# EAGLE design mp28164-buck-boost-flashlight-driver-tester-mk-2.0.3 (EAGLE 9.2.2)
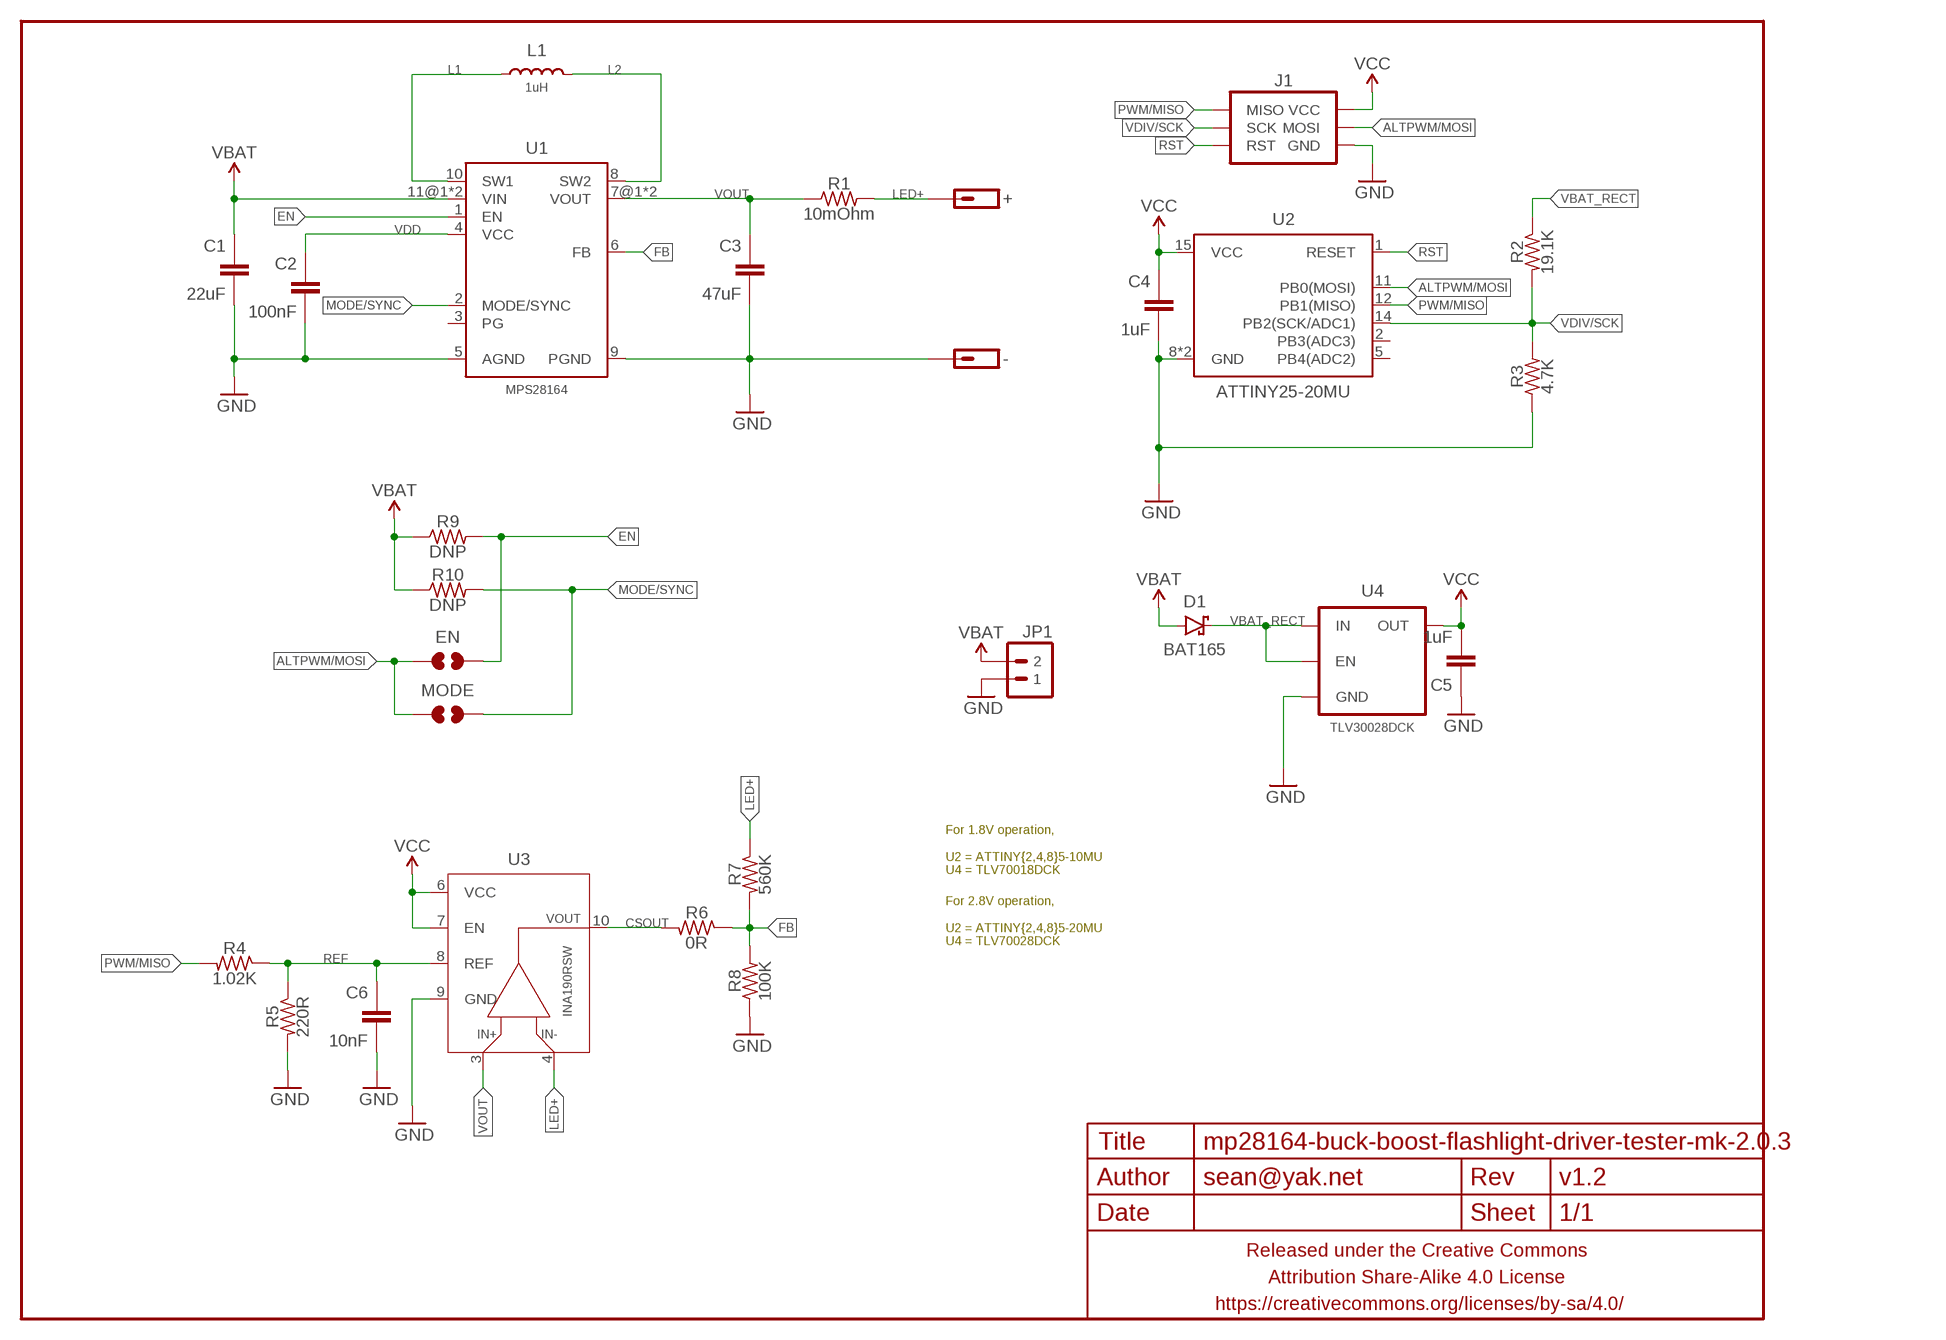
[diagram p0: schematic, sheet 1]

## Parts
+  M01PTH-1.2MM-NS  [1X01-1.2MM-NS]
-  M01PTH-1.2MM-NS  [1X01-1.2MM-NS]
C1  22uF  CAPACITOR-CERAMICC1206  [C1206]
C2  100nF  CAPACITOR-CERAMICC0402  [C0402]
C3  47uF  CAPACITOR-CERAMICC1206  [C1206]
C4  1uF  CAPACITOR-CERAMICC0402  [C0402]
C5  1uF  CAPACITOR-CERAMICC0402  [C0402]
C6  10nF  CAPACITOR-CERAMICC0402  [C0402]
D1  BAT165  DIODE-SCHOTTKYSOD323  [SOD323-SCHOTTKY]
EN  JUMPER-PAD-2-NOYES_SILK  [PAD-JUMPER-2-NO_YES_SILK]
FRAME1  FRAME-LETTERNO_PACKAGE  [DUMMY]
J1  AVR_SPI_PRG_6PTH  [2X3]
JP1  M02PTH-CENTERED  [1X02-CENTER]
L1  1uH  INDUCTORXAL60XX  [XAL60XX]
MODE  JUMPER-PAD-2-NOYES_SILK  [PAD-JUMPER-2-NO_YES_SILK]
R1  10mOhm  RESISTORR1206  [R1206]
R2  19.1K  RESISTORR0402  [R0402]
R3  4.7K  RESISTORR0402  [R0402]
R4  1.02K  RESISTORR0402  [R0402]
R5  220R  RESISTORR0402  [R0402]
R6  0R  RESISTORR0402  [R0402]
R7  560K  RESISTORR0402  [R0402]
R8  100K  RESISTORR0402  [R0402]
R9  DNP  RESISTORR0402  [R0402]
R10  DNP  RESISTORR0402  [R0402]
U1  MPS28164  [MPS28164]
U2  ATTINY25-20MU  ATTINY45TINY85-20-QFN  [QFN20]
U3  INA190RSW  [UQFN-10]
U4  TLV30028DCK  V_REG_ENTLV700XXDCR  [SC70]

## Nets
ALTPWM/MOSI: EN.1 J1.4(MOSI) MODE.1 U2.11(PB0(MOSI))
CSOUT: R6.2 U3.10(OUT)
EN: EN.2 R9.2 U1.1(EN)
FB: R6.1 R7.2 R8.2 U1.6(FB)
GND: -.P$1 C1.2 C2.2 C3.2 C4.2 C5.1 C6.2 J1.6(GND) JP1.1 R3.1 R5.2 R8.1 U1.5(AGND) U1.9(PGND) U2.8(GND) U2.PAD(GND) U3.9(GND) U4.2(GND)
L1: L1.P$1 U1.10(SW1)
L2: L1.P$2 U1.8(SW2)
LED+: +.P$1 R1.2 R7.1 U3.4(VIN-)
MODE/SYNC: MODE.2 R10.2 U1.2(MODE/SYNC)
PWM/MISO: J1.1(MISO) R4.2 U2.12(PB1(MISO))
REF: C6.1 R4.1 R5.1 U3.8(REF)
RST: J1.5(RST) U2.1(RESET)
VBAT: C1.1 D1.A JP1.2 R9.1 R10.1 U1.11@1(VIN) U1.11@2(VIN)
VBAT_RECT: D1.C R2.1 U4.1(IN) U4.3(EN)
VCC: C4.1 C5.2 J1.2(VCC) U2.15(VCC) U3.6(VCC) U3.7(EN) U4.5(OUT)
VDD: C2.1 U1.4(VCC)
VDIV/SCK: J1.3(SCK) R2.2 R3.2 U2.14(PB2(SCK/ADC1))
VOUT: C3.1 R1.1 U1.7@1(VOUT) U1.7@2(VOUT) U3.3(VIN+)
Unconnected: U1.3(PG) U2.2(PB3(ADC3)) U2.5(PB4(ADC2))

## Notes on the sheet
- For 1.8V operation,
  
  U2 = ATTINY{2,4,8}5-10MU
  U4 = TLV70018DCK
- For 2.8V operation,
  
  U2 = ATTINY{2,4,8}5-20MU
  U4 = TLV70028DCK

## Library data of the parts
+ - = a_parts:M01: Header 1 Standard 1-pin 0.1" header. Use with straight break away headers (SKU : PRT-00116), right angle break away headers (PRT-00553), swiss pins (PRT-00743), machine pins (PRT-00117), and female headers (PRT-00115).
C1-C6 = a_parts:CAPACITOR-CERAMIC: CAPACITOR, European symbol
D1 = a_parts:DIODE-SCHOTTKY: Schottky diodes in SFE's production catalog BAT20J 1A 23V 0.62Vf RB751 120mA 40V 0.37Vf PMEG4005EJ 0.5A 40V 0.42Vf MBRA140 1A 40V 0.5Vf B340A 3A 40V SMA
EN MODE = a_parts:JUMPER-PAD-2-NO
FRAME1 = a_parts:FRAME-LETTER: Schematic Frame Standard 8.5x11 US Letter frame; DESIGNER: sean@yak.net; VERSION: v1.2
J1 = a_parts:AVR_SPI_PRG_6: AVR ISP 6 Pin This is the reduced ISP connector for AVR programming. Common on Arduino. This footprint will take up less PCB space and can be used with a 10-pin to 6-pin adapter such as SKU: BOB-08508 **Special note about "TEST_POINT" package. The stop mask is on the top side, so if you want your programming test points to be on the bottom of your board, make sure to place this package on the bottom side of the board. This also ensure that the orientation to program from the bottom side will be correct.
JP1 = a_parts:M02: Standard 2-pin 0.1" header. Use with - straight break away headers ( PRT-00116) - right angle break away headers (PRT-00553) - swiss pins (PRT-00743) - machine pins (PRT-00117) - female headers (PRT-00115) Molex polarized connector foot print use with: PRT-08233 with associated crimp pins and housings. 2.54_SCREWTERM for use with PRT-10571. 3.5mm Screw Terminal footprints for PRT-08084 5mm Screw Terminal footprints for use with PRT-08433
L1 = a_parts:INDUCTOR: Inductors Basic Inductor/Choke - 0603 and 1206. Footprints are not proven and vary greatly between part numbers. SRN6045- 33uH, 20% 1.4A SDR0403-560KL - 56uH, 10%, 500mA RMS/740mA peak
R1-R10 = a_parts:RESISTOR: RESISTOR, American symbol
U1 = a_parts:MPS28164
U2 = a_parts:ATTINY45: Atmel 8-pin 2/4/8kB flash uC
U3 = a_parts:INA190
U4 = a_parts:V_REG_EN

## Board
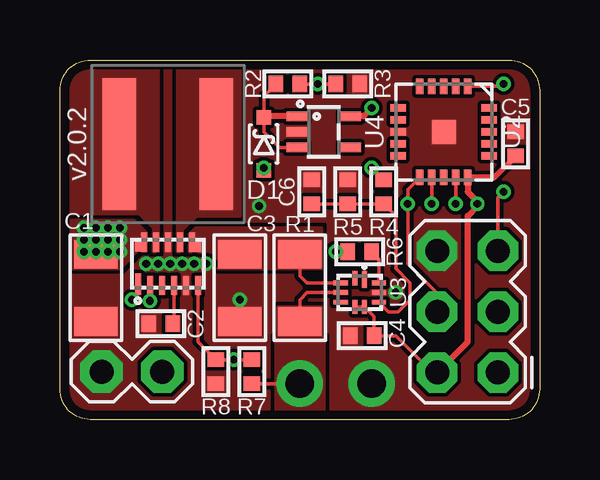
[diagram p1: board, top side]
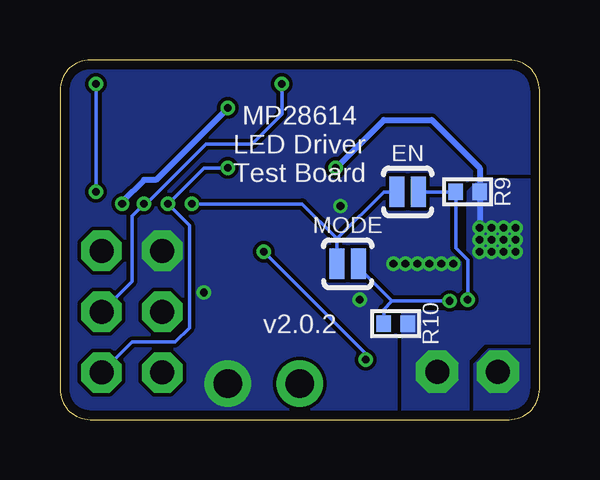
[diagram p2: board, bottom side, seen from below]

Size 20 x 15 mm. Coordinates in mm from the lower left corner, seen from the top.
Outline: 1.27,15 18.73,15 arc-90 20,13.73 20,1.27 arc-90 18.73,0 1.27,0 arc-90 0,1.27 0,13.73 arc-90 1.27,15
Copper layers (1*16): Top 0.035559375mm / dielectric 1.6mm / Bottom 0.035559375mm
Design rules "oshpark-2layer": minimum track width 6mil, minimum drill 10mil, track to track 6mil, track to pad 6mil, pad to pad 6mil, via to via 6mil, smd to smd 0mil, copper to edge 15mil, drill to drill 6mil, minimum pad ring 5mil, minimum via ring 5mil, stop-mask expansion 2.5mil, vias tented up to drill 20mil, thermal gap 10mil

### Footprints (pad centres in the part's own frame; a part is rotated, then mirrored left to right if it is on the bottom)
1X01-1.2MM-NS = drill 1.2 pad 1.93: P$1 0,0
C1206 = smd 1.2 x 1.8: 1 -1.4,0; 2 1.4,0
C0402 = smd 0.6 x 0.7: 1 -0.5,0; 2 0.5,0
SOD323-SCHOTTKY = smd 0.6 x 0.6: A -1.1,0; C 1.1,0
PAD-JUMPER-2-NO_YES_SILK = smd 0.635 x 1.27: 1 -0.45,0; 2 0.45,0
2X3 = drill 1 pad 1.676 octagon: 1 -2.54,-1.27; 2 -2.54,1.27; 3 0,-1.27; 4 0,1.27; 5 2.54,-1.27; 6 2.54,1.27
1X02-CENTER = drill 1 pad 1.778 octagon: 1 -1.27,0; 2 1.27,0
XAL60XX = smd 1.4 x 5.5: P$1 -2.02,0; P$2 2.02,0
R1206 = smd 1.2 x 1.8: 1 -1.4,0; 2 1.4,0
R0402 = smd 0.6 x 0.7: 1 -0.5,0; 2 0.5,0
MPS28164 = smd 0.9 x 0.25: 1 -0.85,1.25 | smd 0.8 x 0.25: 2 -0.9,0.75; 3 -0.9,0.25; 4 -0.9,-0.25; 5 -0.9,-0.75; 6 -0.9,-1.25; 7@1 0.9,-1; 8 0.9,-0.5; 9 0.9,0; 10 0.9,0.5; 11@1 0.9,1 | smd 0.4 x 0.25: 7@2 0.7,-1.25; 11@2 0.71,1.25
QFN20 = smd 0.65 x 0.3: 1 -1.9,1; 2 -1.9,0.5; 3 -1.9,0; 4 -1.9,-0.5; 5 -1.9,-1; 11 1.9,-1; 12 1.9,-0.5; 13 1.9,0; 14 1.9,0.5; 15 1.9,1 | smd 0.3 x 0.65: 6 -1,-1.9; 7 -0.5,-1.9; 8 0,-1.9; 9 0.5,-1.9; 10 1,-1.9; 16 1,1.9; 17 0.5,1.9; 18 0,1.9; 19 -0.5,1.9; 20 -1,1.9 | smd 1 x 1: PAD 0,0
UQFN-10 = smd 0.2 x 0.7: 1 -0.2,-0.55 | smd 0.2 x 0.6: 2 0.2,-0.6; 6 0.2,0.6; 7 -0.2,0.6 | smd 0.6 x 0.2: 3 0.8,-0.4; 4 0.8,0; 5 0.8,0.4; 8 -0.8,0.4; 9 -0.8,0; 10 -0.8,-0.4
SC70 = smd 0.4 x 0.9: 1 -0.65,-1.1; 2 0,-1.1; 3 0.65,-1.1; 4 0.65,1.1; 5 -0.65,1.1

### Placement (x,y rotation side)
+  10,1.5 0 top
-  13,1.5 0 top
C1  1.5,5.5 270 top
C2  4.2,4 180 top
C3  7.5,5.5 270 top
C4  12.6,3.5 180 top
C5  19,11.5 270 top
C6  10.5,9.5 90 top
D1  8.5,11.5 90 top
EN  5.5,9.5 0 bottom
FRAME1  0,0 0 top
J1  17,4.5 90 top
JP1  3,2 0 top
L1  4.5,11.5 0 top
MODE  8,6.5 0 bottom
R1  10,5.5 270 top
R2  9.5,14 0 top
R3  12,14 180 top
R4  13.5,9.5 90 top
R5  12,9.5 90 top
R6  12.5,7 0 top
R7  8,2 90 top
R8  6.5,2 90 top
R9  3,9.5 180 bottom
R10  6,4 180 bottom
U1  4.5,6.5 90 top
U2  16,12 270 top
U3  12.5,5.3 180 top
U4  11,12 270 top

### Tracks (layer width: path | path; a pad name or v marks a point on that pad's centre or on a via)
ALTPWM/MOSI  (via drill 0.33)
  Top 0.152: J1.4 15.73,5.27 14.5,6.5 v14.5,9 14.5,9.6 U2.11
  Bottom 0.152: MODE.1 8.45,7.55 | 8.45,7.55 6.5,9.5 EN.1 | v14.5,9 9.9,9 8.45,7.55
CSOUT
  Top 0.152: U3.10 13.3,6.7 R6.2
EN  (via drill 0.33)
  Top 0.152: U1.1 3.25,5.25 v3,5
  Bottom 0.152: v3,5 3,6.66 3.5,7.16 R9.2 EN.2
FB  (via drill 0.33)
  Top 0.152: U1.6 5.75,3.25 R8.2 v7.25,2.5 R7.2 | R6.1 v11.5,7
  Bottom 0.152: v11.5,7 7.25,2.75 v7.25,2.5
GND  (via drill 0.33)
  other vias: 14,5.3 7.5,5 8.3,8.9 3.6,6.5 4.1,6.5 4.6,6.5 5.1,6.5 5.6,6.5 6.1,6.5
  pour Top (rank 6, no thermals): 0,0 20,0 20,15 0,15
  pour Bottom (rank 6, no thermals): 20,0 0,0 0,15 20,15
L1
  pour Top (rank 4, no thermals): 3.9,7 3.9,8 3.3,8.6 0,8.6 0,15 4.1,15 4.1,7
L2
  pour Top (rank 4, no thermals): 4.9,7 4.9,15 7.5,15 7.5,8.5 5.7,8.5 5.1,7.9 5.1,7
LED+
  Top 0.152: R1.2 10,5 10.3,5.3 U3.4 | R7.1 +.P$1
  pour Top (rank 5, no thermals): 9.1,4.7 10.9,4.7 10.9,3.5 11,3.4 11,0 9,0 9,3.4 9.1,3.5
MODE/SYNC  (via drill 0.33)
  Top 0.152: U1.2 v3.75,4.95
  Bottom 0.152: v3.75,4.95 6.15,4.95 | MODE.2 7.55,6.34 6.15,4.95 | 6.15,4.95 6.5,4.6 R10.2
PWM/MISO  (via drill 0.33)
  Top 0.152: R4.2 v13,10.5 | U2.12 v15.5,9
  Bottom 0.152: v13,10.5 14,10.5 v15.5,9 14.6,8.1 14.6,3.83 15.2,3.23 17,3.23 J1.1
REF
  Top 0.152: C6.1 R5.1 R4.1 14,8.5 14,6.3 14.6,5.7 14.6,5 14.1,4.5 13.7,4.5 U3.8
RST  (via drill 0.33)
  Top 0.152: v18.5,9.5 18.27,9.27 J1.5 | U2.1 18.4,13.9 v18.5,14
  Bottom 0.152: v18.5,14 v18.5,9.5
VBAT  (via drill 0.33)
  Top 0.25: D1.A v8.5,10.5
  Bottom 0.25: v8.5,10.5 6.5,12.5 4.5,12.5 2.5,10.5 v2.5,8
  other vias: 1,7.5 1.5,7.5 2,7.5 2,8 1.5,8 1,8 2.5,7.5 2.5,7 2,7 1.5,7 1,7
  pour Bottom (rank 5, no thermals): 0,10 2.5,10 3,9.5 3,4.5 5.7,4.5 5.7,0 3,0 3,2.5 2.3,3.2 0,3.2
  pour Top (rank 5, no thermals): 0,6.3 2.5,6.3 3.6,7.4 3.6,7.8 2.9,8.5 0,8.5
VBAT_RECT
  Top 0.152: U4.3 9.15,11.35 8.5,12 D1.C 8.5,13.5 R2.1
  Top 0.25: U4.1 8.55,12.65 D1.C
VCC  (via drill 0.33)
  Top 0.152: U3.6 U3.7 13.1,4.3 C4.1 14,3.5 15.54,1.96 J1.2
  Top 0.25: J1.2 17,3.23 17,8.5 17.4,8.9 v17.4,9 17.4,9.1 17,9.5 U2.15 18.1,10.1 C5.2 | v13,13 12.65,12.65 U4.5
  Bottom 0.25: v13,13 16,10 16.5,10 17.4,9.1 v17.4,9
VDD
  Top 0.152: U1.4 4.75,4.05 C2.1
VDIV/SCK  (via drill 0.33)
  Top 0.152: R2.2 v10.75,14 R3.2 | U2.14 v16.5,9
  Bottom 0.152: J1.3 17,5.77 17,8.5 v16.5,9 16.4,9 13.9,11.5 12,11.5 10.75,12.75 v10.75,14
VOUT
  Top 0.152: R1.1 10,6 10.3,5.7 U3.3
  pour Top (rank 5, no thermals): 5.4,7.8 5.4,7 6.3,7 6.6,6.7 6.6,6.3 10.9,6.3 10.9,8 5.6,8

### Text on the board
bPlace: MP28614 / LED Driver / Test Board